# EAGLE design ecg_module_v2.0.1_jan2024 (EAGLE 9.6.2)

## Sheet 1 of 3: Connectors
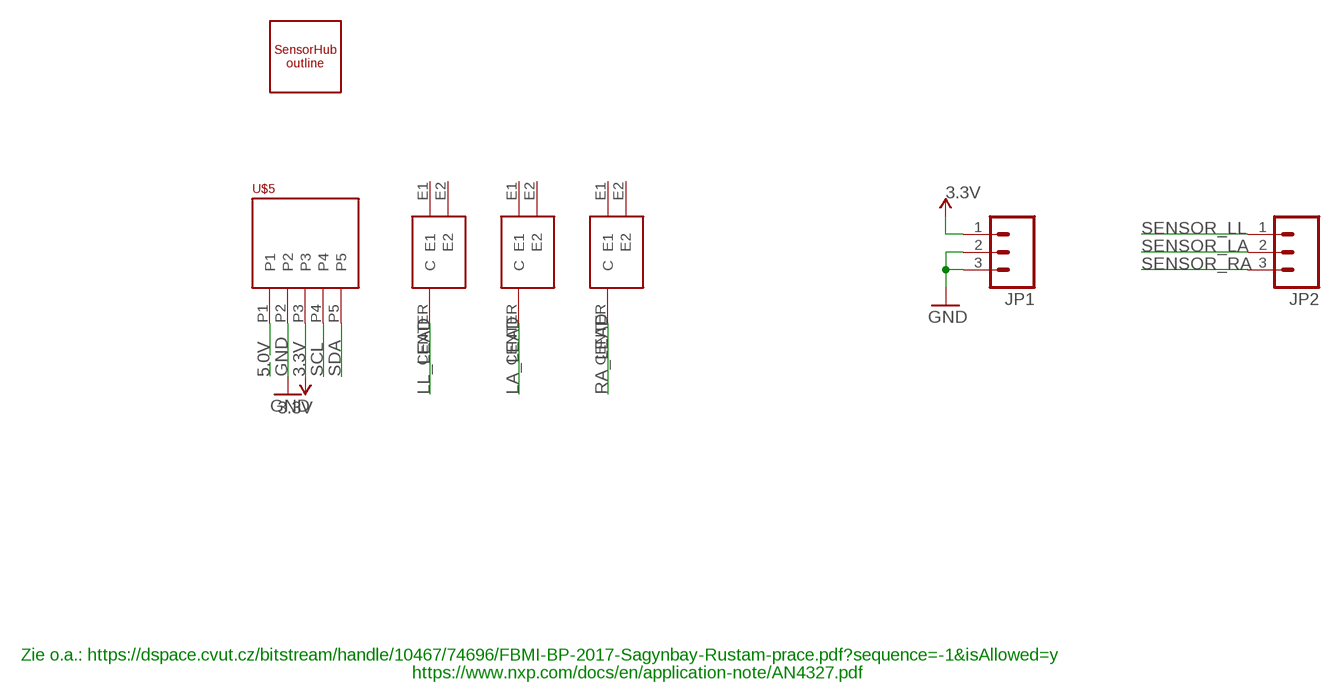
[diagram p0: schematic, sheet 1]

### Parts
JP1  M03PTH  [1X03]
JP2  M03PTH  [1X03]
U$1  DIN_ECG_EEG  [EEG_ECG_DIN]
U$3  DIN_ECG_EEG  [EEG_ECG_DIN]
U$4  DIN_ECG_EEG  [EEG_ECG_DIN]
U$5  PHOENIX_PTSM_M5_TH_I2C++  [PTSM_M5_THRHOLE]
U$12  SENSORHUB_PROFILEUSB_LEFT  [SENSORHUB_OUTLINE_USB_NOTCH_LEFT]

### Nets
3.3V: JP1.1 U$5.P3 ; supply symbol labelled VCC ; also sheet 2,3
5.0V: U$5.P1 ; also sheet 2
GND: JP1.2 JP1.3 U$5.P2 ; also sheet 2,3
LA_LEAD: U$3.CENTER(C) ; also sheet 3
LL_LEAD: U$1.CENTER(C) ; also sheet 3
RA_LEAD: U$4.CENTER(C) ; also sheet 3
SCL: U$5.P4 ; also sheet 2
SDA: U$5.P5 ; also sheet 2
SENSOR_LA: JP2.2 ; also sheet 2
SENSOR_LL: JP2.1 ; also sheet 2
SENSOR_RA: JP2.3 ; also sheet 2
Unconnected: U$1.E1 U$1.E2 U$3.E1 U$3.E2 U$4.E1 U$4.E2

### Notes on the sheet
- Zie o.a.: https://dspace.cvut.cz/bitstream/handle/10467/74696/FBMI-BP-2017-Sagynbay-Rustam-prace.pdf?sequence=-1&isAllowed=y
- https://www.nxp.com/docs/en/application-note/AN4327.pdf

## Sheet 2 of 3: Microcontroller
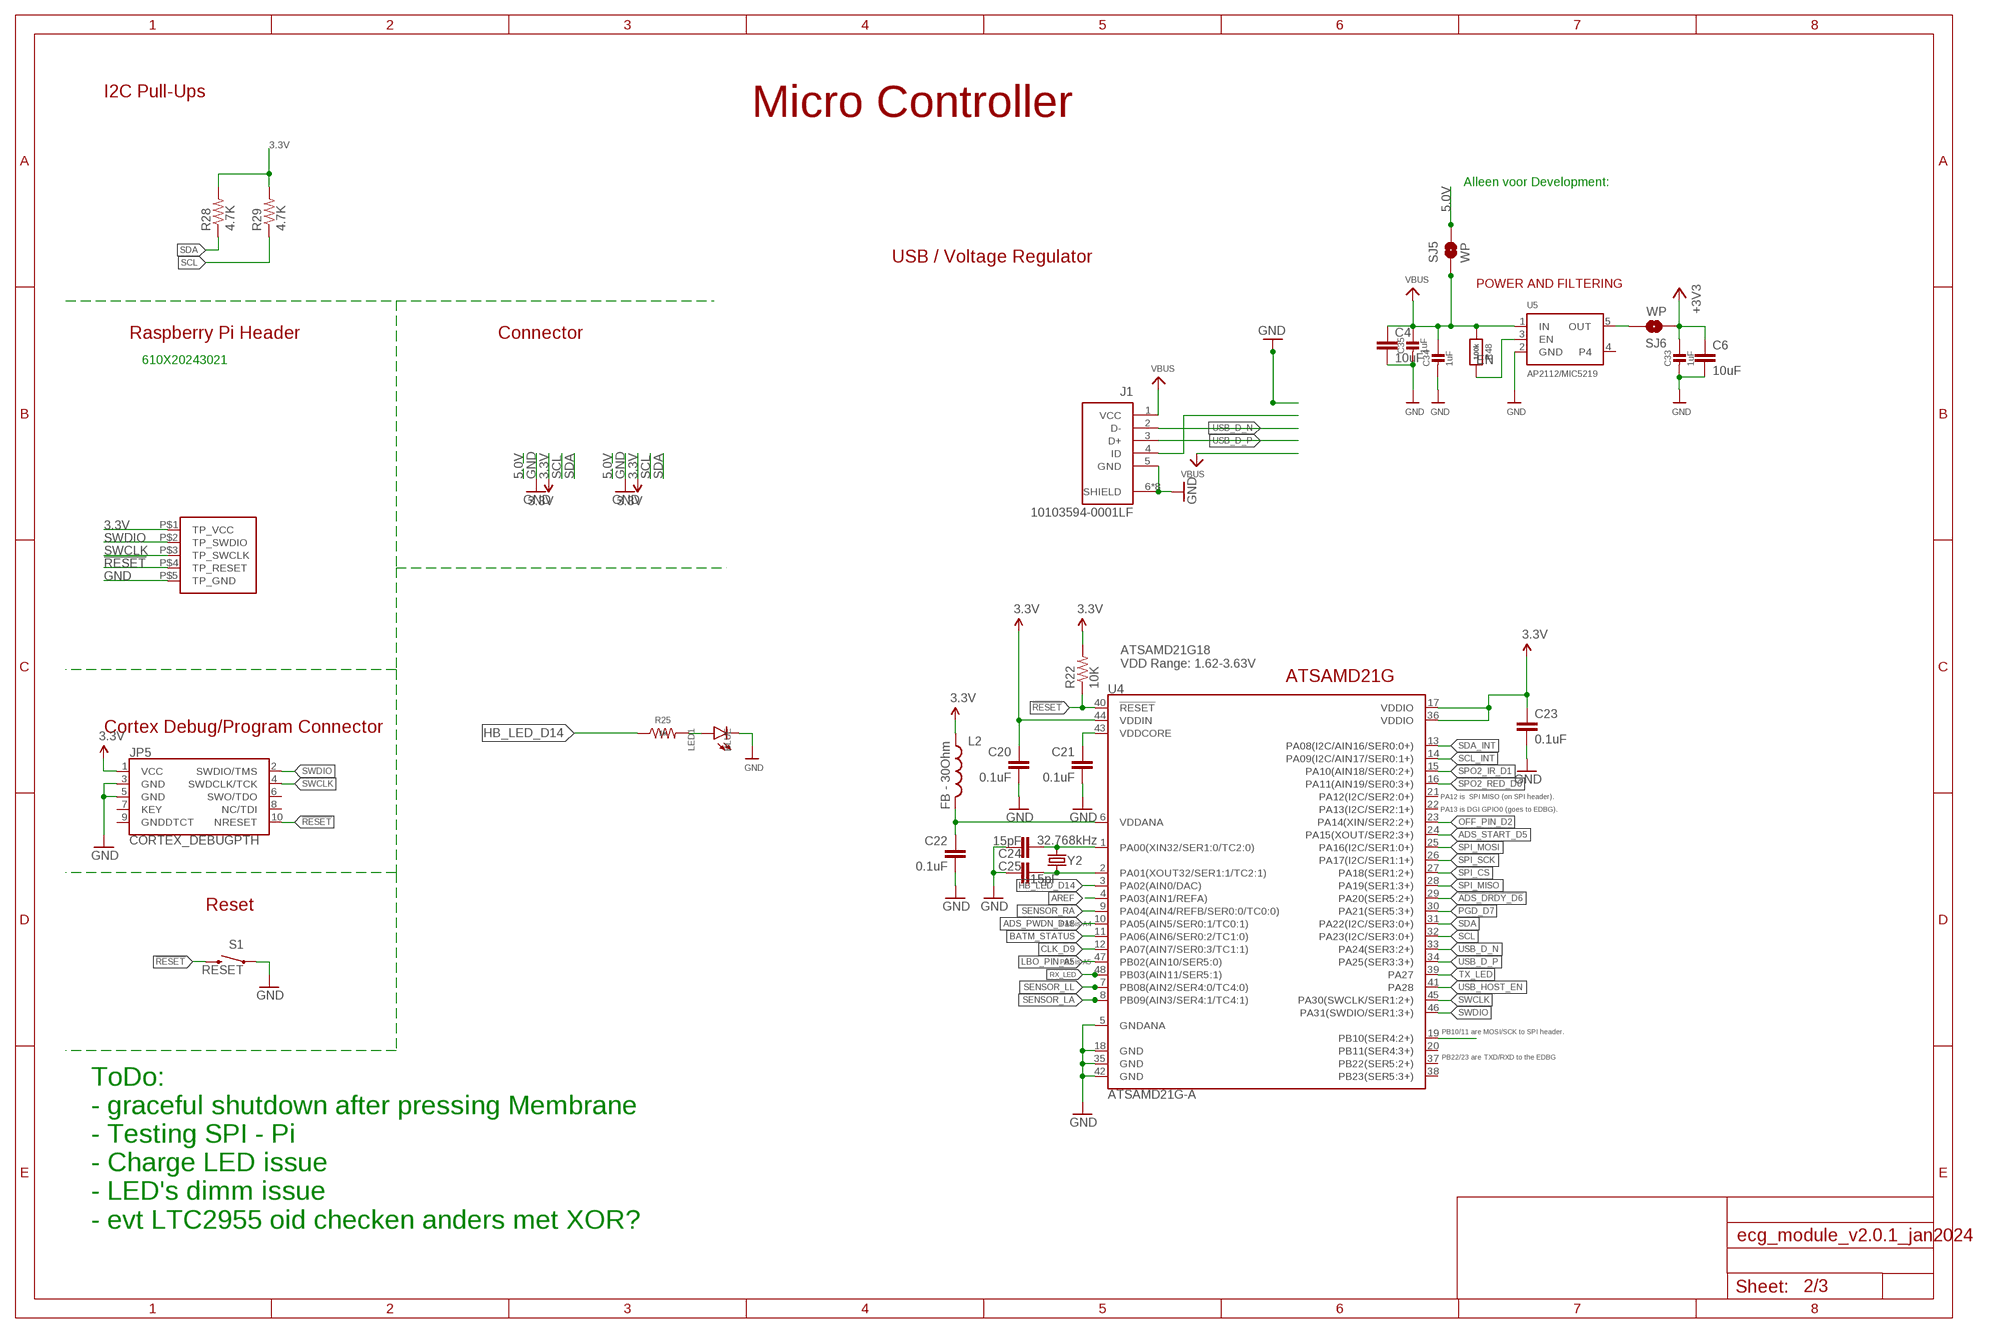
[diagram p1: schematic, sheet 2]

### Parts
C4  10uF  10UF-0603-6.3V-20%  [0603]
C6  10uF  10UF-0603-6.3V-20%  [0603]
C20  0.1uF  0.1UF-16V(+-10%)(0402)  [0402-CAP]
C21  0.1uF  0.1UF-0603-25V-(+80/-20%)  [0603]
C22  0.1uF  0.1UF-16V(+-10%)(0402)  [0402-CAP]
C23  0.1uF  0.1UF-16V(+-10%)(0402)  [0402-CAP]
C24  15pF  15PF-50V(+-5%)(0402)  [0402-CAP]
C25  15pF  15PF-50V(+-5%)(0402)  [0402-CAP]
C33  1uF  CAP_CERAMIC0603_NO  [0603-NO]
C34  1uF  CAP_CERAMIC0603_NO  [0603-NO]
C35  1uF  CAP_CERAMIC0603_NO  [0603-NO]
J1  10103594-0001LF  [AMPHENOL_10103594-0001LF]
JP5  CORTEX_DEBUGPTH  [2X5-PTH-1.27MM]
L2  FB - 30Ohm  INDUCTOR0603  [0603]
LED1  BLUE  LEDCHIP-LED0603  [CHIP-LED0603]
R22  10K  10KOHM-1/10W-1%(0603)0603  [0603-RES]
R25  1k  1KOHM-0603-1/10W-1%  [0603]
R28  4.7K  4.7KOHM-1/10W-1%(0603)  [0603-RES]
R29  4.7K  4.7KOHM-1/10W-1%(0603)  [0603-RES]
R48  100k  RESISTOR_0603_NOOUT  [0603-NO@1]
S1  RESET  SWITCH-MOMENTARY-2SMD-4.6X2.8MM  [TACTILE_SWITCH_SMD_4.6X2.8MM]
SJ5  WP  JUMPER-SMT_2_NO_NO-SILK  [SMT-JUMPER_2_NO_NO-SILK]
SJ6  WP  JUMPER-SMT_2_NO_NO-SILK  [SMT-JUMPER_2_NO_NO-SILK]
U4  ATSAMD21G-A  [TQFP-48]
U5  AP2112/MIC5219  VREG_SOT23-5  [SOT23-5]
U$9  HUB_TESTPINSHUBS  [TEST_PINS]
Y2  32.768kHz  CRYSTAL3.2X1.5MM  [CRYSTAL-SMD-3.2X1.5MM]

### Nets
3.3V: C6.1 C20.1 C23.1 C33.1 JP5.1(VCC) L2.1 R22.2 R28.2 R29.2 SJ6.1 U4.17(VDDIO) U4.36(VDDIO) U4.44(VDDIN) U$9.P$1(TP_VCC) ; supply symbol labelled +3V3 ; also sheet 1,3
5.0V: SJ5.2 ; also sheet 1
!ADS_DRDY_D6: U4.29(PA20(SER5:2+)) ; also sheet 3
!RESET: JP5.10(NRESET) R22.1 S1.3 S1.4 U4.40(!RESET!) U$9.P$4(TP_RESET)
ADS_PWDN_D18: U4.10(PA05(AIN5/SER0:1/TC0:1)) ; also sheet 3
ADS_START_D5: U4.24(PA15(XOUT/SER2:3+)) ; also sheet 3
AREF: U4.4(PA03(AIN1/REFA))
BATM_STATUS: U4.11(PA06(AIN6/SER0:2/TC1:0))
CLK_D9: U4.12(PA07(AIN7/SER0:3/TC1:1)) ; also sheet 3
EN: R48.2 U5.3(EN)
GND: C4.2 C6.2 C20.2 C21.2 C22.2 C23.2 C24.1 C25.2 C33.2 C34.2 C35.2 J1.5(GND) J1.6(SHIELD) J1.7(SHIELD) J1.8(SHIELD) J1.9(SHIELD) J1.10(SHIELD) J1.11(SHIELD) J1.S1(SHIELD) J1.S2(SHIELD) JP5.3(GND) JP5.5(GND) LED1.C S1.1 S1.2 U4.5(GNDANA) U4.18(GND) U4.35(GND) U4.42(GND) U5.2(GND) U$9.P$5(TP_GND) ; also sheet 1,3
HB_LED_D14: R25.1 U4.3(PA02(AIN0/DAC))
LBO_PIN_A5: U4.47(PB02(AIN10/SER5:0))
N$1: LED1.A R25.2
N$2: J1.4(ID)
N$21: U4.19(PB10(SER4:2+))
N$46: C24.2 U4.1(PA00(XIN32/SER1:0/TC2:0)) Y2.P$2
N$47: C25.1 U4.2(PA01(XOUT32/SER1:1/TC2:1)) Y2.P$1
OFF_PIN_D2: U4.23(PA14(XIN/SER2:2+))
OUT: SJ6.2 U5.5(OUT)
PGD_D7: U4.30(PA21(SER5:3+))
RX_LED: U4.48(PB03(AIN11/SER5:1))
SCL: R29.1 U4.32(PA23(I2C/SER3:0+)) ; also sheet 1
SCL_INT: U4.14(PA09(I2C/AIN17/SER0:1+))
SDA: R28.1 U4.31(PA22(I2C/SER3:0+)) ; also sheet 1
SDA_INT: U4.13(PA08(I2C/AIN16/SER0:0+))
SENSOR_LA: U4.8(PB09(AIN3/SER4:1/TC4:1)) ; also sheet 1
SENSOR_LL: U4.7(PB08(AIN2/SER4:0/TC4:0)) ; also sheet 1
SENSOR_RA: U4.9(PA04(AIN4/REFB/SER0:0/TC0:0)) ; also sheet 1
SPI_CS: U4.27(PA18(SER1:2+)) ; also sheet 3
SPI_MISO: U4.28(PA19(SER1:3+)) ; also sheet 3
SPI_MOSI: U4.25(PA16(I2C/SER1:0+)) ; also sheet 3
SPI_SCK: U4.26(PA17(I2C/SER1:1+)) ; also sheet 3
SPO2_IR_D1: U4.15(PA10(AIN18/SER0:2+))
SPO2_RED_D0: U4.16(PA11(AIN19/SER0:3+))
SWCLK: JP5.4(SWDCLK/TCK) U4.45(PA30(SWCLK/SER1:2+)) U$9.P$3(TP_SWCLK)
SWDIO: JP5.2(SWDIO/TMS) U4.46(PA31(SWDIO/SER1:3+)) U$9.P$2(TP_SWDIO)
TX_LED: U4.39(PA27)
USB_D_N: J1.2(D-) U4.33(PA24(SER3:2+))
USB_D_P: J1.3(D+) U4.34(PA25(SER3:3+))
USB_HOST_EN: U4.41(PA28)
VBUS: C4.1 C34.1 C35.1 J1.1(VCC) R48.1 SJ5.1 U5.1(IN)
VDDANA: C22.1 L2.2 U4.6(VDDANA)
VDDCORE: C21.1 U4.43(VDDCORE)
Unconnected: JP5.6(SWO/TDO) JP5.7(KEY) JP5.8(NC/TDI) JP5.9(GNDDTCT) U4.20(PB11(SER4:3+)) U4.21(PA12(I2C/SER2:0+)) U4.22(PA13(I2C/SER2:1+)) U4.37(PB22(SER5:2+)) U4.38(PB23(SER5:3+)) U5.4

### Notes on the sheet
- I2C Pull-Ups | Micro Controller
- Alleen voor Development:
- USB / Voltage Regulator
- POWER AND FILTERING
- Raspberry Pi Header | Connector
- 610X20243021
- ATSAMD21G18
  VDD Range: 1.62-3.63V
- ATSAMD21G
- Cortex Debug/Program Connector
- PA12 is  SPI MISO (on SPI header).
- PA13 is DGI GPIO0 (goes to EDBG).
- Reset
- PA5 is A4
- PB2 is A5
- PB10/11 are MOSI/SCK to SPI header.
- PB22/23 are TXD/RXD to the EDBG
- ToDo:
  - graceful shutdown after pressing Membrane
  - Testing SPI - Pi
  - Charge LED issue
  - LED's dimm issue
  - evt LTC2955 oid checken anders met XOR?

## Sheet 3 of 3: ECG
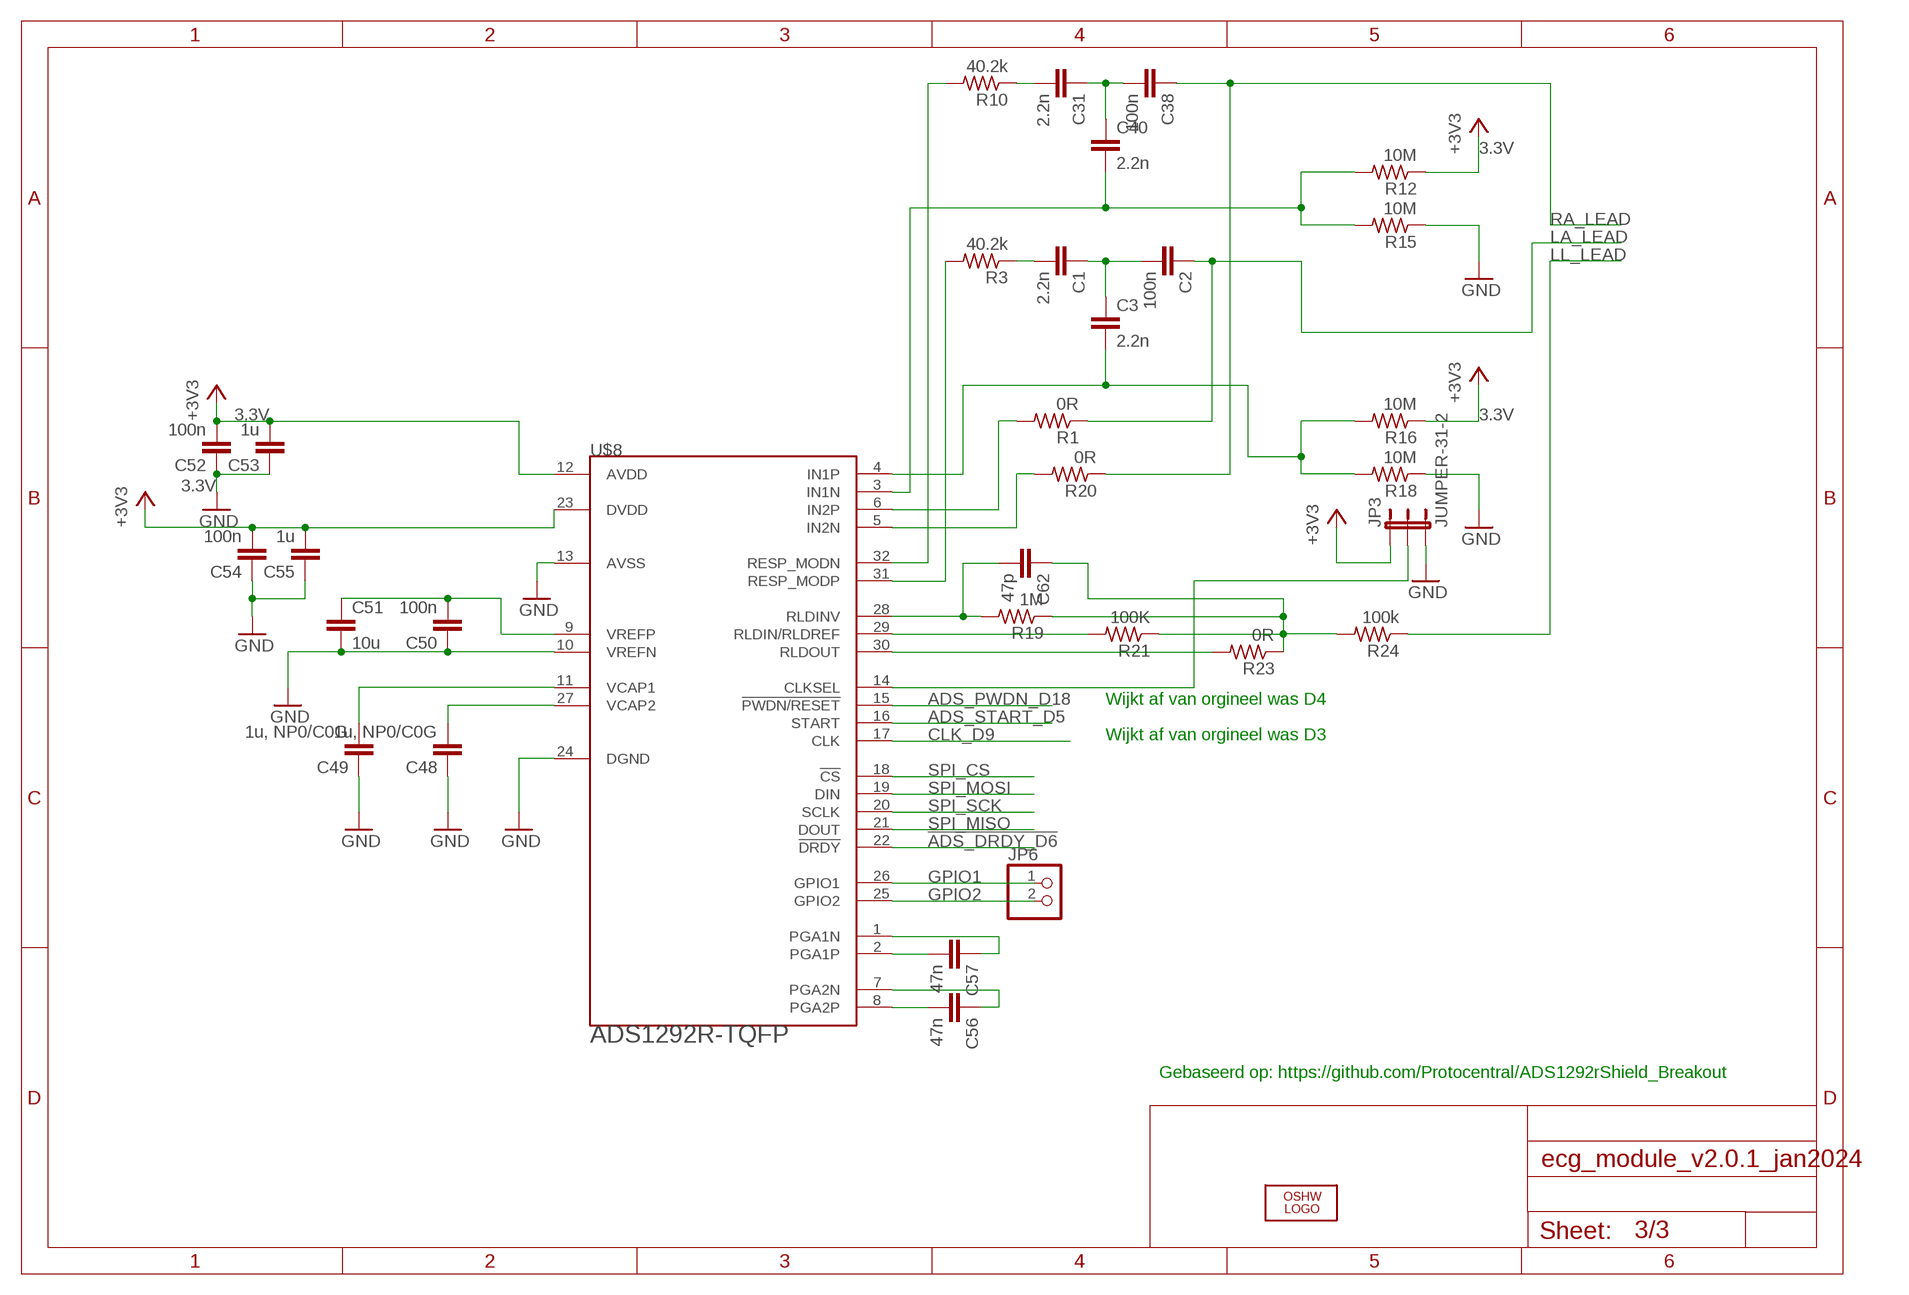
[diagram p2: schematic, sheet 3]

### Parts
C1  2.2n  C-EUC0402  [C0402]
C2  100n  C-EUC0402  [C0402]
C3  2.2n  C-EUC0402  [C0402]
C31  2.2n  C-EUC0402  [C0402]
C38  100n  C-EUC0402  [C0402]
C40  2.2n  C-EUC0402  [C0402]
C48  1u, NP0/C0G  C-EUC0402  [C0402]
C49  1u, NP0/C0G  C-EUC0402  [C0402]
C50  100n  C-EUC0402  [C0402]
C51  10u  C-EUC0603  [C0603]
C52  100n  C-EUC0402  [C0402]
C53  1u  C-EUC0402  [C0402]
C54  100n  C-EUC0402  [C0402]
C55  1u  C-EUC0402  [C0402]
C56  47n  C-EUC0402  [C0402]
C57  47n  C-EUC0402  [C0402]
C62  47p  C-EUC0402  [C0402]
JP3  JUMPER-31-2  [SJ_3_PASTE1&2]
JP6  PINHD-1X2  [1X02]
LOGO1  OSHW_LOGO_FILLX0100-NT  [OSHW_FILLX100_NOTEXT]
R1  0R  R-US_R0402  [R0402]
R3  40.2k  R-US_R0402  [R0402]
R10  40.2k  R-US_R0402  [R0402]
R12  10M  R-US_R0402  [R0402]
R15  10M  R-US_R0402  [R0402]
R16  10M  R-US_R0402  [R0402]
R18  10M  R-US_R0402  [R0402]
R19  1M  R-US_R0402  [R0402]
R20  0R  R-US_R0402  [R0402]
R21  100K  R-US_R0402  [R0402]
R23  0R  R-US_R0402  [R0402]
R24  100k  R-US_R0402  [R0402]
U$8  ADS1292R-TQFP  [SQFP-S-5X5-32]

### Nets
3.3V: C52.2 C53.2 C54.2 C55.2 JP3.1 R12.1 R16.1 U$8.12(AVDD) U$8.23(DVDD) ; supply symbol labelled +3V3 ; also sheet 1,2
!ADS_DRDY_D6: U$8.22(!DRDY) ; also sheet 2
ADS_PWDN_D18: U$8.15(!PWDN/RESET) ; also sheet 2
ADS_START_D5: U$8.16(START) ; also sheet 2
CLK_D9: U$8.17(CLK) ; also sheet 2
GND: C48.1 C49.1 C50.1 C51.2 C52.1 C53.1 C54.1 C55.1 JP3.3 R15.1 R18.1 U$8.10(VREFN) U$8.13(AVSS) U$8.24(DGND) ; also sheet 1,2
GPIO1: JP6.1 U$8.26(GPIO1)
GPIO2: JP6.2 U$8.25(GPIO2)
LA_LEAD: C2.1 R1.1 ; also sheet 1
LL_LEAD: R24.1 ; also sheet 1
N$8: R3.2 U$8.31(RESP_MODP)
N$10: C1.2 R3.1
N$11: C1.1 C2.2 C3.1
N$12: R1.2 U$8.6(IN2P)
N$14: R20.2 U$8.5(IN2N)
N$19: C48.2 U$8.27(VCAP2)
N$26: R10.2 U$8.32(RESP_MODN)
N$28: C31.2 R10.1
N$29: C31.1 C38.2 C40.1
N$31: C40.2 R12.2 R15.2 U$8.3(IN1N)
N$32: C3.2 R16.2 R18.2 U$8.4(IN1P)
N$33: R21.2 U$8.29(RLDIN/RLDREF)
N$34: C62.2 R19.2 U$8.28(RLDINV)
N$35: C62.1 R19.1 R21.1 R23.1 R24.2
N$36: C49.2 U$8.11(VCAP1)
N$37: C56.2 U$8.8(PGA2P)
N$38: C56.1 U$8.7(PGA2N)
N$40: C50.2 C51.1 U$8.9(VREFP)
N$41: C57.2 U$8.2(PGA1P)
N$43: C57.1 U$8.1(PGA1N)
N$50: R23.2 U$8.30(RLDOUT)
N$104: JP3.2 U$8.14(CLKSEL)
RA_LEAD: C38.1 R20.1 ; also sheet 1
SPI_CS: U$8.18(!CS) ; also sheet 2
SPI_MISO: U$8.21(DOUT) ; also sheet 2
SPI_MOSI: U$8.19(DIN) ; also sheet 2
SPI_SCK: U$8.20(SCLK) ; also sheet 2

### Notes on the sheet
- Wijkt af van orgineel was D4
- Wijkt af van orgineel was D3
- Gebaseerd op: https://github.com/Protocentral/ADS1292rShield_Breakout

## Library data of the parts
C1-C3 C31 C38 C40 C48-C50 C52-C57 C62 = rcl:C-EU: CAPACITOR, European symbol; SPICEPREFIX: C
C4 C6 = SparkFun-Capacitors:10UF: 10.0µF ceramic capacitors A capacitor is a passive two-terminal electrical component used to store electrical energy temporarily in an electric field.; PROD_ID: CAP-11015
C20 C22 C23 = SparkFun-Capacitors:0.1UF-16V(+-10%)(0402); PROD_ID: CAP-12416
C21 = SparkFun-Capacitors:0.1UF: 0.1µF ceramic capacitors A capacitor is a passive two-terminal electrical component used to store electrical energy temporarily in an electric field.; PROD_ID: CAP-00810
C24 C25 = samd21-temp:15PF-50V(+-5%)(0402); PROD_ID: CAP-13063
C33-C35 = microbuilder:CAP_CERAMIC: Ceramic Capacitors For new designs, use the packages preceded by an '_' character since they are more reliable: The following footprints should be used on most boards: _0402 - Standard footprint for regular board layouts _0603 - Standard footprint for regular board layouts _0805 - Standard footprint for regular board layouts _1206 - Standard footprint for regular board layouts For extremely tight-pitch boards where space is at a premium, the following 'micro-pitch' footprints can be used (smaller pads, no silkscreen outline, etc.): _0402MP - Micro-pitch footprint for very dense/compact boards _0603MP - Micro-pitch footprint for very dense/compact boards _0805MP - Micro-pitch footprint for very dense/compact boards _1206MP - Micro-pitch footprint for very dense/compact boards
C51 = resistor:C-EU: CAPACITOR, European symbol
J1 = 10103594-0001LF:10103594-0001LF: USB - micro B USB 2.0 Receptacle Connector 5 Position Surface Mount, Right Angle; Through Hole Check availability <https://pricing.snapeda.com/parts/10103594-0001LF/AMPHENOL%20ICC%20/%20FCI/view-part?ref=eda>; AVAILABILITY: In Stock; DESCRIPTION: Micro USB 2.0, Input Output Connectors, B TYPE RECEPTACLE; MF: AMPHENOL ICC / FCI; MP: 10103594-0001LF; PACKAGE: None; PRICE: None; PURCHASE-URL: https://pricing.snapeda.com/search/part/10103594-0001LF/?ref=eda
JP1 JP2 = SparkFun:M03: Header 3 Standard 3-pin 0.1" header. Use with straight break away headers (SKU : PRT-00116), right angle break away headers (PRT-00553), swiss pins (PRT-00743), machine pins (PRT-00117), and female headers (PRT-00115). Molex polarized connector foot print use with SKU : PRT-08232 with associated crimp pins and housings.
JP3 = SparkFun:JUMPER-3
JP5 = samd21-temp:CORTEX_DEBUG: Cortex Debug Connector Datasheet <http://infocenter.arm.com/help/topic/com.arm.doc.faqs/attached/13634/cortex_debug_connectors.pdf>
JP6 = pinhead:PINHD-1X2: PIN HEADER
L2 = SparkFun-Passives:INDUCTOR: Inductors Basic Inductor/Choke - 0603 and 1206. Footprints are not proven and vary greatly between part numbers. INDUCTOR POWER 3.3UH 4.0A SMD 0.197" L x 0.197" W x 0.177" H (5.00mm x 5.00mm x 4.50mm); PROD_ID: RES-07859
LED1 = led:LED: LED OSRAM: - CHIPLED LG R971, LG N971, LY N971, LG Q971, LY Q971, LO R971, LY R971 LH N974, LH R974 LS Q976, LO Q976, LY Q976 LO Q996 - Hyper CHIPLED LW Q18S LB Q993, LB Q99A, LB R99A - SideLED LS A670, LO A670, LY A670, LG A670, LP A670 LB A673, LV A673, LT A673, LW A673 LH A674 LY A675 LS A676, LA A676, LO A676, LY A676, LW A676 LS A679, LY A679, LG A679 - Hyper Micro SIDELED® LS Y876, LA Y876, LO Y876, LY Y876 LT Y87S - SmartLED LW L88C, LW L88S LB L89C, LB L89S, LG L890 LS L89K, LO L89K, LY L89K LS L896, LA L896, LO L896, LY L896 - TOPLED LS T670, LO T670, LY T670, LG T670, LP T670 LSG T670, LSP T670, LSY T670, LOP T670, LYG T670 LG T671, LOG T671, LSG T671 LB T673, LV T673, LT T673, LW T673 LH T674 LS T676, LA T676, LO T676, LY T676, LB T676, LH T676, LSB T676, LW T676 LB T67C, LV T67C, LT T67C, LS T67K, LO T67K, LY T67K, LW E67C LS E67B, LA E67B, LO E67B, LY E67B, LB E67C, LV E67C, LT E67C LW T67C LS T679, LY T679, LG T679 LS T770, LO T770, LY T770, LG T770, LP T770 LB T773, LV T773, LT T773, LW T773 LH T774 LS E675, LA E675, LY E675, LS T675 LS T776, LA T776, LO T776, LY T776, LB T776 LHGB T686 LT T68C, LB T68C - Hyper Mini TOPLED® LB M676 - Mini TOPLED Santana® LG M470 LS M47K, LO M47K, LY M47K Source: http://www.osram.convergy.de LUXEON: - LUMILED® LXK2-PW12-R00, LXK2-PW12-S00, LXK2-PW14-U00, LXK2-PW14-V00 LXK2-PM12-R00, LXK2-PM12-S00, LXK2-PM14-U00 LXK2-PE12-Q00, LXK2-PE12-R00, LXK2-PE12-S00, LXK2-PE14-T00, LXK2-PE14-U00 LXK2-PB12-K00, LXK2-PB12-L00, LXK2-PB12-M00, LXK2-PB14-N00, LXK2-PB14-P00, LXK2-PB14-Q00 LXK2-PR12-L00, LXK2-PR12-M00, LXK2-PR14-Q00, LXK2-PR14-R00 LXK2-PD12-Q00, LXK2-PD12-R00, LXK2-PD12-S00 LXK2-PH12-R00, LXK2-PH12-S00 LXK2-PL12-P00, LXK2-PL12-Q00, LXK2-PL12-R00 Source: www.luxeon.com KINGBRIGHT: KA-3528ASYC Source: www.kingbright.com
LOGO1 = ohw-logo:OSHW_LOGO_FILL
R1 R3 R10 R12 R15 R16 R18-R21 R23 R24 = rcl:R-US_: RESISTOR, American symbol; SPICEPREFIX: R
R22 = SparkFun-Resistors:10KOHM-1/10W-1%(0603): RES-00824; PROD_ID: RES-00824
R25 = SparkFun-Resistors:1KOHM: 1kΩ resistor A resistor is a passive two-terminal electrical component that implements electrical resistance as a circuit element. Resistors act to reduce current flow, and, at the same time, act to lower voltage levels within circuits. - Wikipedia; PROD_ID: RES-07856
R28 R29 = SparkFun-Resistors:4.7KOHM-1/10W-1%(0603): RES-07857; PROD_ID: RES-07857
R48 = microbuilder:RESISTOR: Resistors For new designs, use the packages preceded by an '_' character since they are more reliable: The following footprints should be used on most boards: _0402 - Standard footprint for regular board layouts _0603 - Standard footprint for regular board layouts _0805 - Standard footprint for regular board layouts _1206 - Standard footprint for regular board layouts For extremely tight-pitch boards where space is at a premium, the following 'micro-pitch' footprints can be used (smaller pads, no silkscreen outline, etc.): _0402MP - Micro-pitch footprint for very dense/compact boards _0603MP - Micro-pitch footprint for very dense/compact boards _0805MP - Micro-pitch footprint for very dense/compact boards _1206MP - Micro-pitch footprint for very dense/compact boards
S1 = samd21-temp:SWITCH-MOMENTARY-2: Various NO switches- pushbuttons, reed, etc; PROD_ID: SWCH-13065
SJ5 SJ6 = SparkFun-Jumpers:JUMPER-SMT_2_NO: Normally open jumper This jumper has two pads in close proximity to each other. Apply solder to close the connection. Round pads are easier to solder for beginners, but are a lot larger. SparkFun Product that uses the round pads: SparkFun EL Sequencer <https://www.sparkfun.com/products/12781>
U4 = samd21-temp:ATSAMD21G: Atmel SAMD21G SMART ARM-Based Microcontroller The Atmel ® | SMART ™ SAM D21 is a series of low-power microcontrollers using the 32-bit ARM ® Cortex ® -M0+ processor, and ranging from 32- to 64-pins with up to 256KB Flash and 32KB of SRAM. The SAM D21 devices operate at a maximum frequency of 48MHz and reach 2.46 CoreMark/MHz. They are designed for simple and intuitive migration with identical peripheral modules, hex compatible code, identical linear address map and pin compatible migration paths between all devices in the product series. All devices include intelligent and flexible peripherals, Atmel Event System for inter-peripheral signaling, and support for capacitive touch button, slider and wheel user interfaces.; PROD_ID: IC-13064
U5 = microbuilder:VREG_SOT23-5: SOT23-5 Fixed Voltage Regulators Part Current Out V Out V In V Dropout θJA (°C/W) TJ (°C) Digikey Part No. ADP121 150mA 3.3V 3.4-5.5V 0.09V @ 150mA -- -- ADP121-AUJZ33R7CT-ND ADP121 150mA 3.0V 3.1-5.5V 0.09V @ 150mA -- -- ADP121-AUJZ30R7CT-ND ADP122 300mA 3.3V 3.4-5.5V 0.085V @ 300mA -- -- ADP122AUJZ-3.3-R7CT-ND ADP1712 300mA 3.3V 3.5-5.5V 0.17V @ 300mA -- -- ADP1712AUJZ-3.3-R7TR-ND AP7311 (Low Cost) 150mA 3.3V 3.5-6V 0.15V @ 150mA -- -- AP7311-33WG-7DICT-ND LD39015M18R 150mA 1.8V 1.9V-5.5V 0.08V @ 100mA -- -- 497-6977-1-ND LP2985A-33DBVR 150mA 3.3V 3.3-16V 0.28V @ 150mA 206 150 296-18479-1-ND MCP1824T-3302E/OT 300mA 3.3V 3.5V-6V 0.2V @ 300mA -- -- MCP1824T-3302E/OTCT-ND MIC5205-2.5YM5 TR 150mA 2.5V 2.7-16V 0.165V @ 150mA -- -- 576-1257-2-ND MIC5205-3.0YM5 TR 150mA 3.0V 3.2V-16V 0.165V @ 150mA -- -- 576-1258-2-ND MIC5205-3.3YM5 TR 150mA 3.3V 3.5V-16V 0.165V @ 150mA -- -- 576-1259-2-ND TPS780330220 150mA 3.3V+2.2V 3.6-5.5V 250mV Max -- -- 296-23332-1-ND TDA3663/N1,135 100mA 3.3V 3.5-45V 0.18V @ 50mA -- -- 568-5343-1-ND Max operating temp can be calculated using θJA, TJ (max junction temperature), and power in watts. Set the "Maximum Ambient Temperature" until it reaches TJ ("Max Junction Temperature"), which is the absolute limit for safe use of the regulator: Heat Sink Temperature Calculator <http://www.daycounter.com/Calculators/Heat-Sink-Temperature-Calculator.phtml> For example, With 12V source into a 3.3V LP2985 and a 30mA load, we are dissipating (12V-3.3V) * 0.03A = 0.261W. With a θJA of 206 °C/W, a TJ of 150°C, and 261mW we can safely use the chip without a heat sink up to 75°C (=147.1°C Junction Temperature).
U$1 U$3 U$4 = jk_customs:DIN_ECG_EEG
U$5 = jk_customs:PHOENIX_PTSM_M5_TH: Datasheet Phoenix PTSM 0,5/ 5-HH-2,5-THR R32 <https://www.phoenixcontact.com/online/portal/us?uri=pxc-oc-itemdetail:pid=1778654&library=usen&pdfmode=direct&pdflanguage=en>
U$8 = circuitects:ADS1292R-TQFP
U$9 = jk_customs:HUB_TESTPINS
U$12 = jk_customs:SENSORHUB_PROFILE
Y2 = samd21-temp:CRYSTAL: Various standard crystals. Proven footprints.; PROD_ID: XTAL-13062

## Net classes
1 usb: width 0.152 mm, drill 0.254 mm, clearance 0.152 mm
2 ground: width 0.254 mm, drill 0.254 mm, clearance 0.152 mm
3 power: width 0.254 mm, drill 0.254 mm, clearance 0.152 mm

## Board
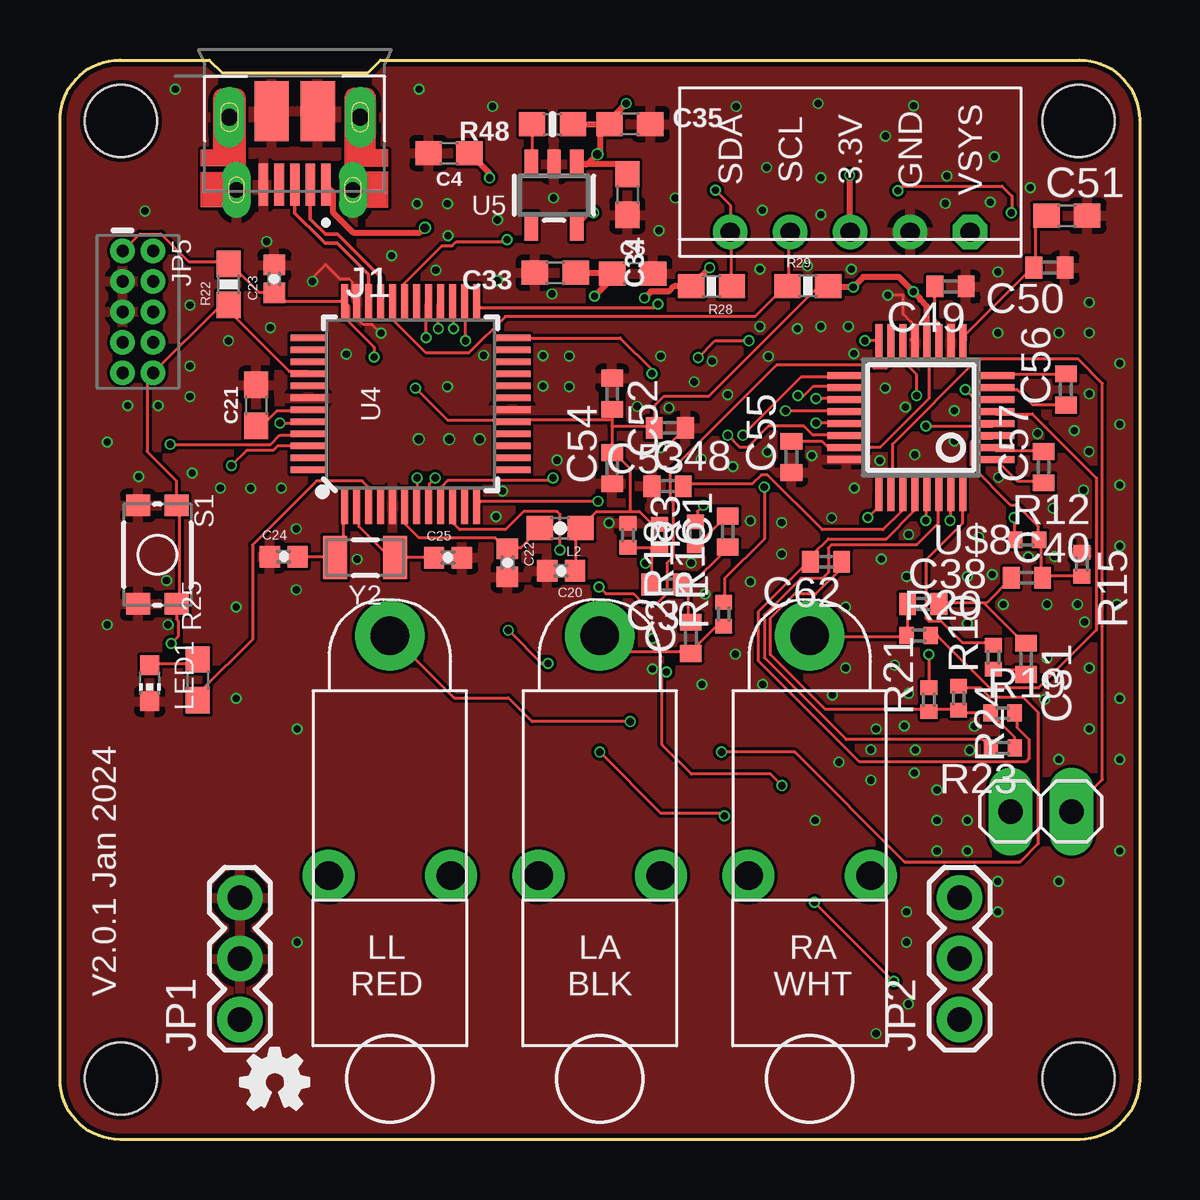
[diagram p3: board, top side]
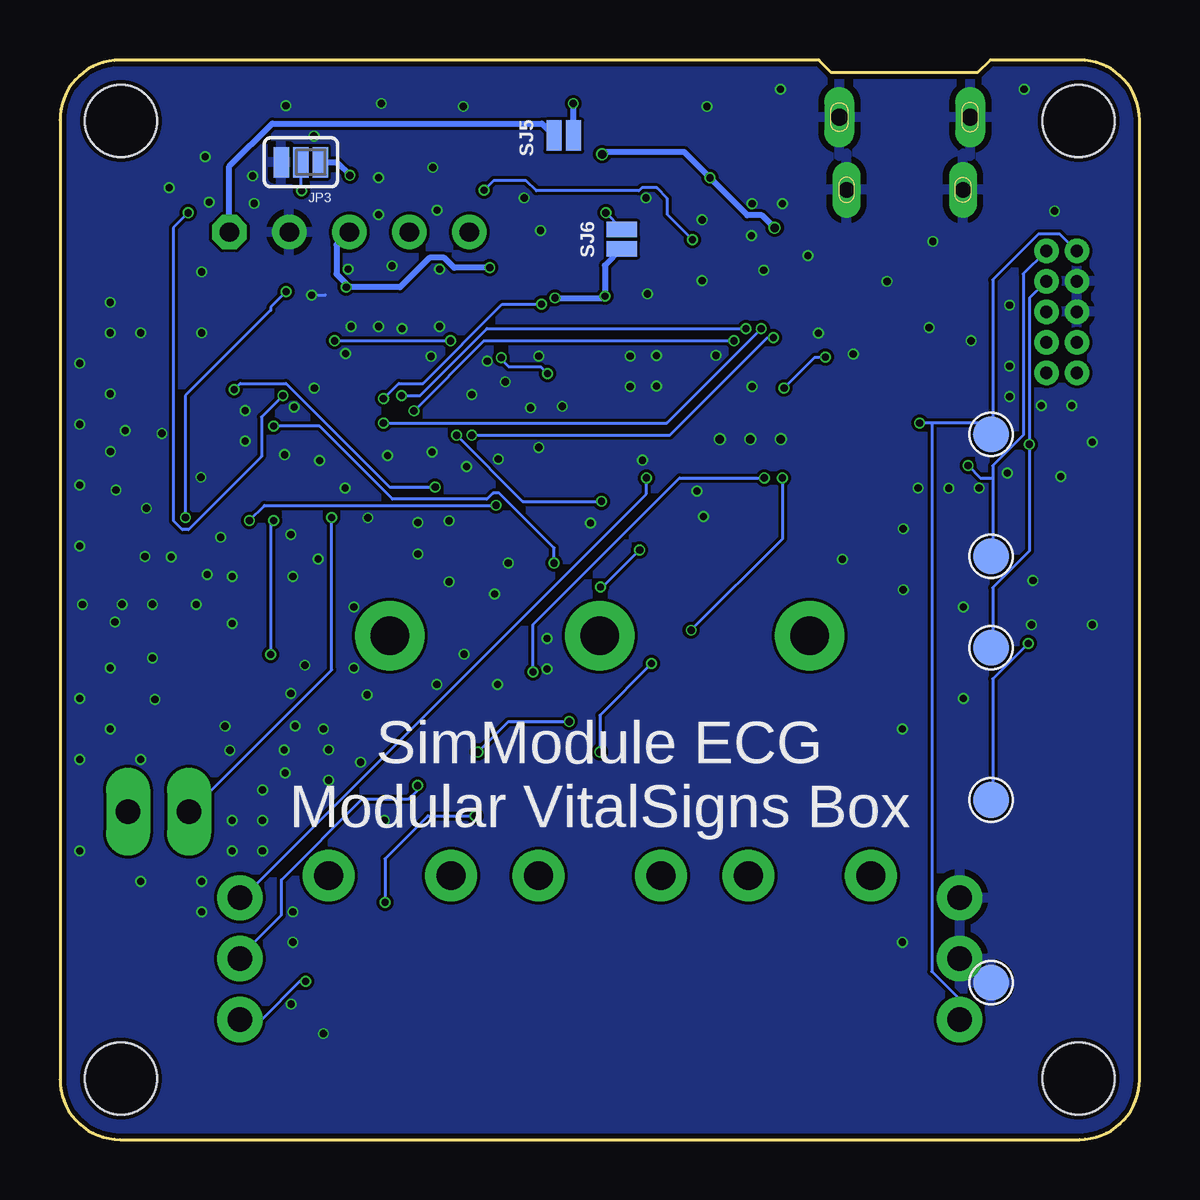
[diagram p4: board, bottom side, seen from below]

Size 45 x 45 mm. Coordinates in mm from the lower left corner, seen from the top.
Copper layers (1*16): Top 0.035mm / dielectric 1.6mm / Bottom 0.035mm
Design rules "jlcpcb-2layers_2023": minimum track width 5mil, minimum drill 0.3mm, track to track 5mil, track to pad 5mil, pad to pad 5mil, via to via 5mil, smd to smd 5mil, copper to edge 0.2mm, drill to drill 6mil, minimum pad ring 10mil, minimum via ring 3mil, stop-mask expansion 4mil, vias tented up to drill 20mil, thermal gap 10mil

### Footprints (pad centres in the part's own frame; a part is rotated, then mirrored left to right if it is on the bottom)
C0402 = smd 0.7 x 0.9: 1 -0.65,0; 2 0.65,0
0603 = smd 1.1 x 1: 1 -0.85,0; 2 0.85,0
0402-CAP = smd 0.85 x 0.9: 1 -0.58,0; 2 0.58,0
0603-NO = smd 1.1 x 1: 1 -0.85,0; 2 0.85,0
C0603 = smd 1.1 x 1: 1 -0.85,0; 2 0.85,0
AMPHENOL_10103594-0001LF = smd 0.4 x 1.75: 1 -1.3,2.825; 2 -0.65,2.825; 3 0,2.825; 4 0.65,2.825; 5 1.3,2.825 | drill 0.65 pad 0.73 long: 6 -2.425,3.03; 7 2.425,3.03 | drill 0.7 pad 1.2 long: 8 -2.725,0; 9 2.725,0 | smd 1.05 x 2.1 bottom: 10 -2.425,3.03; 11 2.425,3.03 | smd 1.425 x 2.5: S1 -0.963,-0.25; S2 0.963,-0.25
1X03 = drill 1.016 pad 1.88: 1 0,0; 2 2.54,0; 3 5.08,0
SJ_3_PASTE1&2 = smd 0.635 x 1.27: 1 -0.813,0; 2 0,0; 3 0.813,0
2X5-PTH-1.27MM = drill 0.508 pad 1: 1 -2.54,-0.635; 2 -2.54,0.635; 3 -1.27,-0.635; 4 -1.27,0.635; 5 0,-0.635; 6 0,0.635; 7 1.27,-0.635; 8 1.27,0.635; 9 2.54,-0.635; 10 2.54,0.635
1X02 = drill 1.016 long: 1 -1.27,0; 2 1.27,0
CHIP-LED0603 = smd 0.8 x 0.8: A 0,-0.75; C 0,0.75
R0402 = smd 0.6 x 0.7: 1 -0.5,0; 2 0.5,0
0603-RES = smd 1.1 x 1: 1 -0.85,0; 2 0.85,0
0603-NO@1 = smd 1.075 x 1: 1 -0.85,0; 2 0.85,0
TACTILE_SWITCH_SMD_4.6X2.8MM = smd 0.9 x 1: 1 -2.05,-0.8; 2 2.05,-0.8; 3 2.05,0.8; 4 -2.05,0.8
SMT-JUMPER_2_NO_NO-SILK = smd 0.635 x 1.27: 1 -0.406,0; 2 0.406,0
TQFP-48 = smd 1.5 x 0.28: 1 -4.25,2.75; 2 -4.25,2.25; 3 -4.25,1.75; 4 -4.25,1.25; 5 -4.25,0.75; 6 -4.25,0.25; 7 -4.25,-0.25; 8 -4.25,-0.75; 9 -4.25,-1.25; 10 -4.25,-1.75; 11 -4.25,-2.25; 12 -4.25,-2.75; 25 4.25,-2.75; 26 4.25,-2.25; 27 4.25,-1.75; 28 4.25,-1.25; 29 4.25,-0.75; 30 4.25,-0.25; 31 4.25,0.25; 32 4.25,0.75; 33 4.25,1.25; 34 4.25,1.75; 35 4.25,2.25; 36 4.25,2.75 | smd 0.28 x 1.5: 13 -2.75,-4.25; 14 -2.25,-4.25; 15 -1.75,-4.25; 16 -1.25,-4.25; 17 -0.75,-4.25; 18 -0.25,-4.25; 19 0.25,-4.25; 20 0.75,-4.25; 21 1.25,-4.25; 22 1.75,-4.25; 23 2.25,-4.25; 24 2.75,-4.25; 37 2.75,4.25; 38 2.25,4.25; 39 1.75,4.25; 40 1.25,4.25; 41 0.75,4.25; 42 0.25,4.25; 43 -0.25,4.25; 44 -0.75,4.25; 45 -1.25,4.25; 46 -1.75,4.25; 47 -2.25,4.25; 48 -2.75,4.25
SOT23-5 = smd 0.55 x 1.2: 1 -0.95,-1.3; 2 0,-1.3; 3 0.95,-1.3; 4 0.95,1.3; 5 -0.95,1.3
EEG_ECG_DIN = drill 1.6: CENTER 0,0 | drill 1.2: E1 10,2.55; E2 10,-2.55
PTSM_M5_THRHOLE = drill 0.8 octagon: P1 5,1 | drill 0.8: P2 2.5,1; P3 0,1; P4 -2.5,1; P5 -5,1
SQFP-S-5X5-32 = smd 0.3 x 1.6: 1 -1.75,-3.1; 2 -1.25,-3.1; 3 -0.75,-3.1; 4 -0.25,-3.1; 5 0.25,-3.1; 6 0.75,-3.1; 7 1.25,-3.1; 8 1.75,-3.1; 17 1.75,3.1; 18 1.25,3.1; 19 0.75,3.1; 20 0.25,3.1; 21 -0.25,3.1; 22 -0.75,3.1; 23 -1.25,3.1; 24 -1.75,3.1 | smd 1.6 x 0.3: 9 3.1,-1.75; 10 3.1,-1.25; 11 3.1,-0.75; 12 3.1,-0.25; 13 3.1,0.25; 14 3.1,0.75; 15 3.1,1.25; 16 3.1,1.75; 25 -3.1,1.75; 26 -3.1,1.25; 27 -3.1,0.75; 28 -3.1,0.25; 29 -3.1,-0.25; 30 -3.1,-0.75; 31 -3.1,-1.25; 32 -3.1,-1.75
TEST_PINS = smd 1.5 x 1.5 bottom: P$1 6.35,29.21; P$2 6.35,24.13; P$3 6.35,20.32; P$4 6.35,13.97; P$5 6.35,6.35
SENSORHUB_OUTLINE_USB_NOTCH_LEFT = hole 3: -19.96,19.96; 19.96,19.96; -19.96,-19.96; 19.96,-19.96
CRYSTAL-SMD-3.2X1.5MM = smd 1 x 1.8: P$1 -1.25,0; P$2 1.25,0

### Placement (x,y rotation side)
C1  27.83,25.34 90 top
C2  26.3,20.91 90 top
C3  25.24,23.14 180 top
C4  16.21,41.12 180 top
C6  23.87,36.1 0 top
C20  20.89,23.71 180 top
C21  8.19,30.6 90 top
C22  18.65,24.04 270 top
C23  8.94,35.87 90 top
C24  9.32,24.3 0 top
C25  16.18,24.26 0 top
C31  40.27,20.04 270 top
C33  20.65,36.13 180 top
C34  23.66,39.39 270 top
C35  23.76,42.32 0 top
C38  35.99,22.32 0 top
C40  40.31,23.41 0 top
C48  25.33,27.24 0 top
C49  37.12,35.56 180 top
C50  41.25,36.34 180 top
C51  41.97,38.5 0 top
C52  23.02,31.09 270 top
C53  25.42,29.66 180 top
C54  23.02,27.99 90 top
C55  30.49,28.46 90 top
C56  41.93,31.26 90 top
C57  41,28.02 90 top
C62  31.94,24.09 180 top
J1  9.79,42.62 180 top
JP1  7.5,5 90 top
JP2  37.5,5 90 top
JP3  34.96,40.74 180 bottom
JP5  3.25,34.5 270 top
JP6  40.89,13.67 180 top
L2  20.85,25.48 180 top
LED1  3.74,19.02 180 top
LOGO1  7.54,1.27 0 top
R1  27.67,21.9 90 top
R3  26.49,25.24 90 top
R10  38.91,20.1 90 top
R12  40.32,25 0 top
R15  42.59,23.99 270 top
R16  24.99,25.14 270 top
R18  23.68,25.19 270 top
R19  39.29,17.78 0 top
R20  35.8,21.01 0 top
R21  36.22,18.33 90 top
R22  7.03,35.64 90 top
R23  39.3,16.33 180 top
R24  37.46,18.4 270 top
R25  5.75,19.16 90 top
R28  27.16,35.57 180 top
R29  31.17,35.58 0 top
R48  20.53,42.32 180 top
S1  4.06,24.38 270 top
SJ5  24,41.85 180 bottom
SJ6  21.58,37.53 90 bottom
U4  14.61,30.67 90 top
U5  20.59,39.37 180 top
U$1  13.75,21 270 top
U$3  22.5,21 270 top
U$4  31.25,21 270 top
U$5  32.94,36.83 0 top
U$8  35.89,30.09 90 top
U$9  -0.16,0.19 0 top
U$12  22.5,22.5 0 top
Y2  12.72,24.26 180 top

### Tracks (layer width: path | path; a pad name or v marks a point on that pad's centre or on a via)
3.3V  (via drill 0.3)
  Top 0.127: C55.2 31.77,29.1 32.02,28.85 32.66,28.85 U$8.23 34.18,28.85 36.22,30.88 36.22,33.17 U$8.12 | v39.77,25.93 39.77,25.04 R12.1 | R29.2 31.64,35.58 27.05,30.98 25.17,30.98 24.77,30.59 C53.2 24.66,29.74 23.01,29.74 | 23.77,26.18 22.37,26.18 21.74,25.55 L2.1 21.61,25.42 21.48,25.29 21.48,23.77 C20.1 | 23.77,26.18 24.15,26.18 24.66,25.68 24.91,25.68 R16.1 | 23.01,29.99 23.01,30.37 C52.2 | 23.01,29.99 23.01,29.74 | 23.01,29.74 23.01,28.72 C54.2 23.14,28.6 23.77,27.96 23.77,26.18 | 23.01,29.99 18.94,29.99 U4.17 18.82,29.99 16.15,29.99 v14.82,31.33 | v9.16,29.87 10.31,29.87 U4.44 | JP5.1 2.69,37.11 3.32,37.74 4.21,37.74 5.36,36.6 7.01,36.6 R22.2 7.13,36.47 8.28,35.33 8.91,35.33 C23.1 9.04,35.2 9.29,34.95 11.83,34.95 U4.36 12.03,34.75 12.03,34.09 13.09,33.03 v13.09,32.61
  Top 0.254: C33.1 23,36.13 C6.1 23.02,35.9 v22.28,35.16 | v24.37,35.08 24.63,35.35 25.38,35.35 25.6,35.57 R28.2 v27.09,36.34 | R29.2 32.08,35.53 v33.07,35.53 33.49,35.95 34.96,35.95 v35.57,35.34 35.86,35.04 35.86,35 36.14,34.73 U$8.12 | v32.91,40.19 32.91,37.85 U$5.P3
  Bottom 0.127: v39.77,25.93 39.77,31.01 36.22,34.56 36.22,34.69 v35.57,35.34 | SJ6.1 21.61,37.11 | 6.12,29.87 6.12,35.84 4.21,37.74 3.32,37.74 2.69,37.11 JP5.1 | 6.12,29.87 6.12,29.48 U$9.P$1 6.12,29.87 | 6.12,29.87 8.66,29.87 | 8.66,29.87 v9.16,29.87 | 8.66,29.87 8.66,7.01 7.51,5.86 7.51,5.1 JP1.1 | v14.82,31.33 13.53,32.61 v13.09,32.61
  Bottom 0.254: 21.61,37.11 22.28,36.43 v22.28,35.16 22.36,35.08 v24.37,35.08 | v27.09,36.34 28.57,36.34 28.98,36.76 29.6,36.76 30.83,35.53 v33.07,35.53 33.07,35.68 33.47,36.08 33.47,37.3 U$5.P3 | JP3.1 33.46,40.74 v32.91,40.19
5.0V
  Bottom 0.254: SJ5.2 24.91,42.35 36.15,42.35 37.94,40.56 U$5.P1
!ADS_DRDY_D6  (via drill 0.3)
  Top 0.127: v15.26,33.42 15.26,34.82 U4.29 | v27.83,29.36 28.34,28.85 28.65,28.85 29.54,29.74 31.01,29.74 31.39,29.36 32.66,29.36 U$8.22
  Bottom 0.127: v15.26,33.42 15.52,33.42 19.58,29.36 v27.83,29.36
!RESET  (via drill 0.3)
  Top 0.127: 6.88,34.69 6.62,34.69 3.96,32.02 JP5.10 3.63,31.71 3.63,28.68 4.85,27.47 4.85,26.44 S1.4 4.97,26.31 4.97,22.37 S1.3 4.86,21.69 4.92,21.63 4.92,20.96 v4.64,20.68 | 6.88,34.69 7.01,34.69 R22.1 6.88,34.69 | 6.88,34.69 9.55,32.02 10.31,32.02 U4.40
  Bottom 0.127: v4.64,20.68 6.12,19.2 6.12,14.24 U$9.P$4
ADS_PWDN_D18  (via drill 0.3)
  Top 0.127: U4.10 16.4,26.31 16.4,25.68 16.66,25.42 18.56,25.42 19.32,26.18 20.72,26.18 20.85,26.06 20.85,24.75 20.84,24.73 v20.84,24.57 | U$8.15 34.56,33.17 34.56,32.28 34.44,32.15 33.93,32.15 33.8,32.28 29.87,32.28 25.42,27.83 25.42,26.69 25.55,26.56 25.55,24.28 25.29,24.02 25.29,22.75 24.91,22.37 24.28,22.37 23.9,22.75 22.75,22.75 v22.48,23.03
  Bottom 0.127: v20.84,24.57 22.38,23.03 v22.48,23.03
ADS_START_D5  (via drill 0.3)
  Top 0.127: v33.55,33.3 34.06,33.3 U$8.16 | U4.24 23.34,33.42 24.67,32.09 v24.67,31.92 | v26.61,32.6 27.3,33.3 v28.72,33.3
  Bottom 0.127: v33.55,33.3 v28.72,33.3 | v24.67,31.92 24.95,32.2 26.29,32.2 26.61,32.52 v26.61,32.6
CLK_D9  (via drill 0.3)
  Top 0.127: v22.42,26.6 17.55,26.6 U4.12 | v28.47,29.36 30.88,31.77 32.66,31.77 U$8.17
  Bottom 0.127: v22.42,26.6 25.71,26.6 v28.47,29.36
EN
  Top 0.127: R48.2 19.71,42.31 19.71,40.79 U5.3
GND  (via drill 0.3, 0.35)
  Top 0.127: U$8.13 35.48,33.35 | 35.48,34.07 35.15,34.4 35.15,35.2 v34.51,35.2 | C53.1 25.26,28.85 v25.04,28.85 | v13.38,33.61 13.02,33.98 12.64,33.98 12.36,34.26 U4.35 12.19,35.09 12.19,35.74 12.08,35.86 11.68,35.86 11.07,36.47 10.52,35.92 v10.52,35.77
  Bottom 0.127: v34.51,35.2 33.93,35.2
  other vias: 21.23,32.66 25.04,32.66 16.15,31.39 14.88,39.01 16.15,39.01 18.23,35.8 18.23,38.34 20.57,39.25 25.65,39.25 28.19,43.06 29.46,40.52 24.96,37.89 29.18,36.28 32.99,36.28 31.72,40.09 35.37,5.65 28.05,28.05 26.73,28.37 20.72,28.32 16.23,29.19 18.45,27.03 18.18,25.97 22.88,25.7 11.93,32.74 7.02,33.3 8.77,33.84 5.42,34.78 5.42,32.24 5.42,30.97 6.69,27.16 9.23,27.16 9.85,25.46 9.85,22.92 12.39,24.19 4.44,23.3 4.5,21.46 1.96,21.46 1.96,29.08 5.51,27.78 27.19,32.44 29.18,33.89 31.72,33.89 34.4,31.33 35.63,28.55 34.17,28.3 33.12,27.16 38.3,25.1 41.4,26.31 39.12,27.61 42.29,29.55 40.75,29.43 42.91,31.09 41.64,33.63 39.1,33.63 39.1,36.17 42.91,34.9 44.18,24.74 44.18,27.28 44.18,29.82 44.18,32.36 42.91,33.63 42.91,19.66 44.18,18.39 42.91,17.12 41.64,15.85 44.18,15.85 44.18,12.04 41.64,10.77 36.56,13.31 34.02,17.12 32.75,19.66 32.75,22.2 35.29,23.47 37.83,23.47 37.83,21.51 34.79,19.77 41.14,22.31 42.41,22.31 44.06,22.3 34.02,4.42 35.29,8.23 31.48,13.31 9.89,8.23 9.89,17.12 7.35,22.2 7.35,18.39 8.62,37.44 3.54,38.71 4.81,43.79 14.97,43.79 13.83,36.84 31.61,43.19 18.03,43.06 17.5,29.19 14.96,29.19 21.23,31.39 20.51,35.25 26.44,31.58 25.38,30.5 24.06,30.56 33.8,16.25 33.8,14.98 32.47,15.73 29.29,18.97 32.2,18.54 30.08,25.71 32.16,25.92 28.79,25.79 28.79,23.25 29.48,28.66 31.34,28.51 26.31,24.04 26.88,22.74 24.7,20.89 24.7,19.62 28.15,20.23 26.75,18.97 35.29,9.5 39.1,9.5 39.1,10.77 37.83,12.04 36.56,12.04 37.83,13.31 36.56,14.58 37.92,16.23 38.12,17.23 35.38,18.59 35.2,17.24 35.66,16.24 35.62,15.29 41.04,18.35 41.14,20.07 42.71,21.57 39.33,22.3 38.87,23.55 40.37,24.28 41.46,24.3 42.67,27.07 42.9,28.67 35.38,25.22 34.23,24.2 30.08,24.41 27.83,31.05 29.54,32.65 30.74,33.8 32.86,33.89 33.09,32.76 31.16,36.42 29.28,38.74 31.72,38.55 34.41,41.83 35.58,43.1 36.97,40.17 36.9,39.02 38.78,39.07 38.95,40.97 40.45,39.68 37.28,30.39 37.28,29.12 35.24,30.53 17.66,32.69 20.14,32.67 20.14,31.4 15.67,36.24 16.18,37.68 7.95,27.15 3.28,27.63 4.1,30.59 2.83,30.59
  pour Top: -3.89,49.53 -3.89,-3.81 50.72,-3.81 50.72,49.53
  pour Bottom: -11.51,46.99 -11.51,-6.35 53.26,-6.35 53.26,46.99
GPIO1
  Top 0.127: U$8.26 34.69,27.07 34.69,28.98 38.25,32.53 42.44,32.53 43.45,31.52 43.45,15.01 42.19,13.74 JP6.1
GPIO2  (via drill 0.3)
  Top 0.127: v33.68,25.93 34.06,26.31 34.06,26.95 U$8.25
  Bottom 0.127: v33.68,25.93 33.68,19.58 39.52,13.74 JP6.2
HB_LED_D14
  Top 0.127: R25.1 5.86,18.44 5.86,18.69 8.02,20.85 8.02,24.79 10.69,27.45 12.59,27.45 12.85,27.2 12.85,26.44 U4.3
LA_LEAD
  Top 0.127: R1.1 27.58,21.36 27.33,21.36 26.31,20.34 C2.1 26.18,20.34 23.14,20.34 22.5,20.98 U$3.CENTER
LL_LEAD  (via drill 0.3)
  Top 0.127: R24.1 37.49,18.82 38.38,18.82 38.76,18.44 40.15,18.44 40.79,17.8 40.79,12.34 40.03,11.58 35.2,11.58 30.63,16.15 v27.58,16.15 | U$1.CENTER 13.86,20.98 16.43,18.41 18.69,18.41 19.68,17.42 v23.77,17.42
  Bottom 0.127: v27.58,16.15 26.31,17.42 v23.77,17.42
N$1
  Top 0.127: LED1.A 3.83,19.83 5.61,19.83 5.74,19.96 R25.2
N$8  (via drill 0.3)
  Top 0.127: v26.82,26.44 26.56,26.18 26.56,25.8 R3.2 | v37.11,25.8 37.11,26.95 U$8.31
  Bottom 0.127: v26.82,26.44 36.47,26.44 v37.11,25.8
N$10
  Top 0.127: R3.1 26.56,24.79 27.83,26.06 C1.2
N$11
  Top 0.127: 26.06,23.01 25.93,23.14 C3.1 26.06,23.01 | 26.06,23.01 26.18,22.88 26.18,21.61 C2.2 | 26.06,23.01 26.18,23.01 27.83,24.66 C1.1
N$12  (via drill 0.3)
  Top 0.127: v29.36,27.2 29.36,25.04 27.71,23.39 27.71,22.5 R1.2 | v37.74,31.26 38.12,30.88 38.88,30.88 U$8.6
  Bottom 0.127: v29.36,27.2 31.26,27.2 35.58,31.52 37.49,31.52 v37.74,31.26
N$14
  Top 0.127: R20.2 36.34,20.98 36.6,20.98 38.76,18.82 40.79,18.82 43.2,21.23 43.2,27.58 40.53,30.25 39.01,30.25 U$8.5
N$19
  Top 0.127: C48.2 26.06,27.33 28.85,27.33 29.23,27.71 29.48,27.71 31.77,25.42 34.31,25.42 35.07,26.18 35.07,26.95 U$8.27
N$26
  Top 0.127: R10.2 38.88,20.72 37.61,20.72 36.72,21.61 36.22,21.61 36.09,21.74 36.09,24.15 37.61,25.68 37.61,26.95 U$8.32
N$28
  Top 0.127: R10.1 39.01,19.58 40.03,19.58 40.15,19.45 C31.2
N$29
  Top 0.127: 38.5,22.37 38.63,22.37 39.64,23.39 C40.1 | 38.5,22.37 36.72,22.37 C38.2 | 38.5,22.37 40.15,20.72 C31.1
N$31
  Top 0.127: R15.2 42.57,23.52 41.04,23.52 C40.2 40.91,23.52 40.91,24.91 R12.2 40.79,25.04 40.79,25.55 39.9,26.44 39.64,26.44 37.99,28.09 37.99,29.1 38.12,29.23 38.88,29.23 U$8.3
N$32  (via drill 0.3)
  Top 0.127: 24.66,24.66 24.91,24.66 R16.2 24.66,24.66 | 24.66,24.66 23.77,24.66 R18.2 | 24.66,24.66 24.66,24.02 | 24.66,24.02 24.66,23.14 C3.2 | v36.09,29.74 38.88,29.74 U$8.4 | 24.66,24.02 v24.41,24.02
  Bottom 0.127: v36.09,29.74 34.18,29.74 31.14,26.69 27.2,26.69 26.95,26.95 26.69,26.95 24.41,24.66 v24.41,24.02
N$33  (via drill 0.3)
  Top 0.127: v36.22,20.21 R21.2 | v36.09,25.8 36.09,26.95 U$8.29
  Bottom 0.127: v36.22,20.21 36.22,25.68 v36.09,25.8
N$34
  Top 0.127: R19.2 39.9,17.67 39.9,17.17 40.41,16.66 40.41,15.9 40.28,15.77 33.3,15.77 29.1,19.96 29.1,21.99 31.26,24.15 C62.2 31.39,24.15 31.39,24.41 32.02,25.04 34.44,25.04 35.58,26.18 35.58,26.95 U$8.28
N$35
  Top 0.127: 36.22,17.93 37.36,17.93 R24.2 37.49,17.8 38.76,17.8 R19.1 38.88,17.67 39.77,16.79 39.77,16.4 R23.1 | 36.22,17.93 31.9,17.93 29.61,20.21 29.61,21.74 30.63,22.75 31.52,22.75 32.53,23.77 32.53,24.02 C62.1 | 36.22,17.93 R21.1
N$36
  Top 0.127: C49.2 36.47,35.45 36.47,34.18 36.6,34.06 36.6,33.3 U$8.11
N$37
  Top 0.127: C56.2 41.93,31.9 39.01,31.9 U$8.8
N$38
  Top 0.127: C56.1 41.93,30.63 40.53,30.63 39.9,31.26 39.01,31.26 U$8.7
N$40
  Top 0.127: C51.1 41.04,38.5 40.66,38.12 40.66,36.34 C50.2 40.53,36.34 37.74,33.55 37.74,33.3 U$8.9
N$41
  Top 0.127: C57.2 40.91,28.72 39.01,28.72 U$8.2
N$43
  Top 0.127: C57.1 40.91,27.45 39.9,27.45 39.01,28.34 U$8.1
N$46
  Top 0.127: C24.2 9.93,24.28 11.45,24.28 Y2.P$2 11.58,24.28 11.83,24.53 11.83,26.31 U4.1
N$47
  Top 0.127: C25.1 15.52,24.28 13.99,24.28 Y2.P$1 13.86,24.15 12.47,25.55 12.47,26.31 U4.2
N$50
  Top 0.127: R23.2 38.46,16.67 32.77,16.67 29.36,20.09 29.36,21.86 30.88,23.39 31.77,23.39 32.02,23.64 32.02,24.66 32.15,24.79 35.71,24.79 36.6,25.68 36.6,26.95 U$8.30
N$104  (via drill 0.3)
  Top 0.127: v35.71,31.01 35.71,31.9 35.2,32.41 35.2,33.17 U$8.14 | v34.93,39.56 35.12,39.75 39.26,39.75 39.68,39.33 39.68,38.65 v39.66,38.63
  Bottom 0.127: v35.71,31.01 36.6,30.12 36.6,28.47 39.64,25.42 39.9,25.42 40.28,25.8 40.28,38.01 v39.66,38.63 | JP3.2 34.96,39.58 v34.93,39.56
OUT  (via drill 0.3)
  Top 0.127: v22.25,38.63 22.12,38.63 21.61,38.12 U5.5
  Bottom 0.127: v22.25,38.63 21.61,37.99 SJ6.2
RA_LEAD
  Top 0.127: C38.1 35.33,22.25 35.33,21.1 R20.1 35.2,20.98 31.26,20.98 U$4.CENTER
SCL
  Top 0.127: U$5.P4 30.37,37.74 30.37,35.58 R29.1 30.25,35.58 28.98,34.31 18.56,34.31 17.04,32.79 15.26,32.79 13.86,34.18 13.86,34.82 U4.32
SDA  (via drill 0.3)
  Top 0.127: R28.1 27.96,35.58 27.96,37.74 U$5.P5 27.94,38.95 v27.33,39.57 | U4.31 14.37,34.95 14.37,35.71 15.92,37.26 16.35,37.26 16.51,37.42 18.55,37.42 v18.64,37.51
  Bottom 0.127: v18.64,37.51 19.68,38.55 19.68,39.23 20.12,39.67 20.74,39.67 20.87,39.54 25.14,39.54 25.57,39.98 26.92,39.98 v27.33,39.57
SENSOR_LA  (via drill 0.3)
  Top 0.127: v15.64,27.58 15.39,27.33 15.39,26.44 U4.8 | v30.09,14.75 29.61,15.24 26.32,15.24 25.1,16.45 25.1,19.32 v25.28,19.49
  Bottom 0.127: JP2.2 37.49,7.64 35.77,9.36 35.77,10.83 32.4,14.19 30.46,14.19 30.09,14.56 v30.09,14.75 | v25.28,19.49 25.28,21.48 19.17,27.58 v15.64,27.58
SENSOR_LL  (via drill 0.3)
  Top 0.127: v14.88,27.58 14.88,26.44 U4.7 | v18.69,21.23 20.07,19.85 v20.34,19.85 | v22.5,16.15 25.04,13.61 27.58,13.61 v27.69,13.5 | v31.45,9.89 34.74,6.6 v34.76,6.6
  Bottom 0.127: v18.69,21.23 14.88,25.04 v14.88,27.58 | v20.34,19.85 22.5,17.69 v22.5,16.15 | JP2.1 36.6,5 35,6.6 v34.76,6.6 | v31.45,9.89 31.45,11.71 29.66,13.5 v27.69,13.5
SENSOR_RA  (via drill 0.3)
  Top 0.127: v20.56,27.58 20.44,27.47 16.16,27.47 15.9,27.2 15.9,26.44 U4.9
  Bottom 0.127: JP2.3 37.38,10.08 20.56,26.91 v20.56,27.58
SPI_CS  (via drill 0.3)
  Top 0.127: v16.4,33.8 16.4,34.82 U4.27 | v30.76,31.01 31.01,31.01 31.39,31.39 32.66,31.39 U$8.18
  Bottom 0.127: v16.4,33.8 27.2,33.8 29.99,31.01 v30.76,31.01
SPI_MISO  (via drill 0.3)
  Top 0.127: v15.77,33.8 15.77,34.82 U4.28 | v31.52,29.87 32.66,29.87 U$8.21
  Bottom 0.127: v15.77,33.8 19.71,29.87 v31.52,29.87
SPI_MOSI  (via drill 0.3)
  Top 0.127: v24.93,34.82 24.77,34.67 17.51,34.67 U4.25 | v31.52,30.88 32.66,30.88 U$8.19
  Bottom 0.127: v24.93,34.82 26.56,34.82 29.87,31.52 30.88,31.52 v31.52,30.88
SPI_SCK  (via drill 0.3)
  Top 0.127: v16.91,33.3 16.91,34.82 U4.26 | v30.25,30.37 32.66,30.37 U$8.20
  Bottom 0.127: v16.91,33.3 27.33,33.3 v30.25,30.37
SWCLK  (via drill 0.3)
  Top 0.127: v4.59,28.98 8.78,28.98 9.16,29.36 10.31,29.36 U4.45
  Bottom 0.127: U$9.P$3 6.12,20.59 6.12,23.01 4.59,24.53 v4.59,28.98 4.59,35.07 3.96,35.71 JP5.4
SWDIO  (via drill 0.3)
  Top 0.127: U4.46 9.08,28.92 8.89,28.72 7.78,28.72 v7.15,28.09
  Bottom 0.127: 6.12,27.58 6.12,28.09 4.85,29.36 4.85,36.09 3.96,36.98 JP5.2 | 6.12,27.58 6.12,24.41 U$9.P$2 | v7.15,28.09 6.64,27.58 6.12,27.58
USB_D_N
  Top 0.152: J1.2 10.44,38.37 11.07,37.74 11.57,37.74 13.36,35.95 U4.33
USB_D_P
  Top 0.152: J1.3 9.79,38.61 10.86,37.54 10.87,37.54 11.05,37.37 11.55,37.37 12.87,36.05 12.86,36.04 U4.34
VBUS  (via drill 0.3, 0.35)
  Top 0.127: 21.61,40.66 U5.1
  Top 0.254: J1.1 11.37,39.51 11.37,38.65 12.22,37.8 15.01,37.8 v15.21,38.01 | U5.1 22,40.67 v22.4,41.07 22.5,41.17 22.5,42.33 | v23.61,43.19 22.91,42.49 C35.1 22.5,42.33 | R48.1 22.5,42.33 | C34.1 23.24,40.66 21.61,40.66 | C4.1 17.91,40.28 v17.91,40.09
  Bottom 0.254: v15.21,38.01 15.73,38.53 16.35,38.53 v17.91,40.09 18.99,41.17 22.3,41.17 v22.4,41.07 | SJ5.1 23.61,41.86 v23.61,43.19
VDDANA
  Top 0.127: L2.2 19.96,25.42 19.2,24.66 18.69,24.66 C22.1 18.56,24.66 18.14,25.08 14.97,25.08 14.37,25.68 14.37,26.31 U4.6
VDDCORE
  Top 0.127: C21.1 8.28,29.87 8.53,29.87 9.04,30.37 10.31,30.37 U4.43

### Text on the board
tSilk: LL / RED | LA / BLK | RA / WHT
_bsilk: SimModule ECG / Modular VitalSigns Box